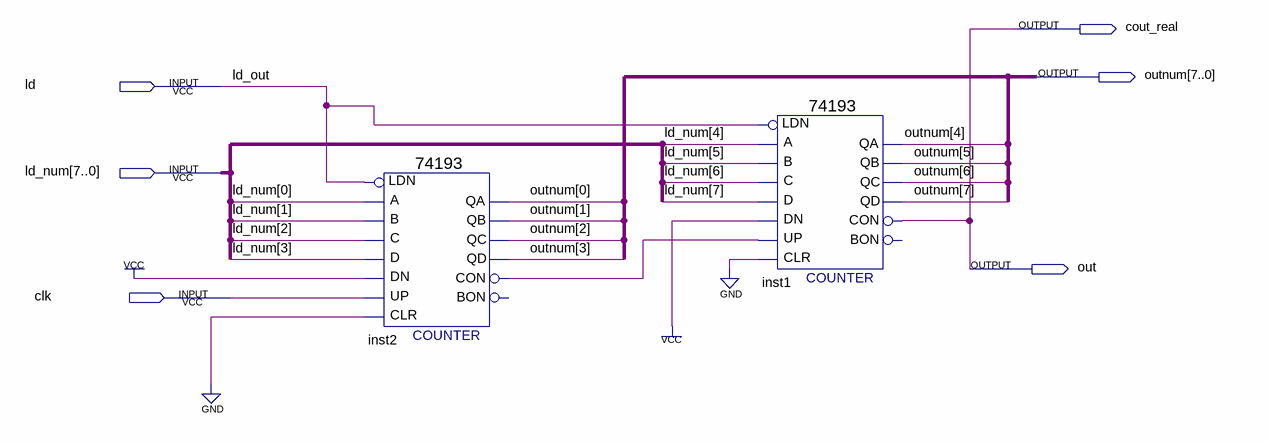
[diagram p0: schematic sheet]
// Quartus schematic lab1_2_1.bdf as structural Verilog: 2 symbols, 6 pins
module lab1_2_1 (
  input  ld,
  input  [7:0] ld_num,
  input  clk,
  output cout_real,
  output [7:0] outnum,
  output out
);

  wire inst2_con;

  \74193  inst2 (
    .D(ld_num[3]), .C(ld_num[2]), .B(ld_num[1]), .A(ld_num[0]), .CLR(1'b0), .UP(clk), .DN(1'b1), .LDN(ld),
    .QB(outnum[1]), .QA(outnum[0]), .CON(inst2_con), .QD(outnum[3]), .QC(outnum[2]));  // open: BON
  \74193  inst1 (
    .D(ld_num[7]), .C(ld_num[6]), .B(ld_num[5]), .A(ld_num[4]), .CLR(1'b0), .UP(inst2_con), .DN(1'b1),
    .LDN(ld), .QB(outnum[5]), .QA(outnum[4]), .CON(cout_real), .QD(outnum[7]), .QC(outnum[6]));  // open: BON

  assign out = cout_real;

  // Other names for the same wires on the sheet: ld_out = ld
endmodule
